# EasyEDA Pro project ESP32C3_Motor_MainControl.eprj, schematic ESP32C3_CAN_Host
Create Date: 2023-12-01; Page Name: ESP32C3PowerKey; Project Name: ESP32C3PowerKey; Schematic Name: ESP32C3PowerKey; Update Date: 2023-12-01; Company: SEU; Drawed: 陈申; Page Size: A4; Version: V1.0
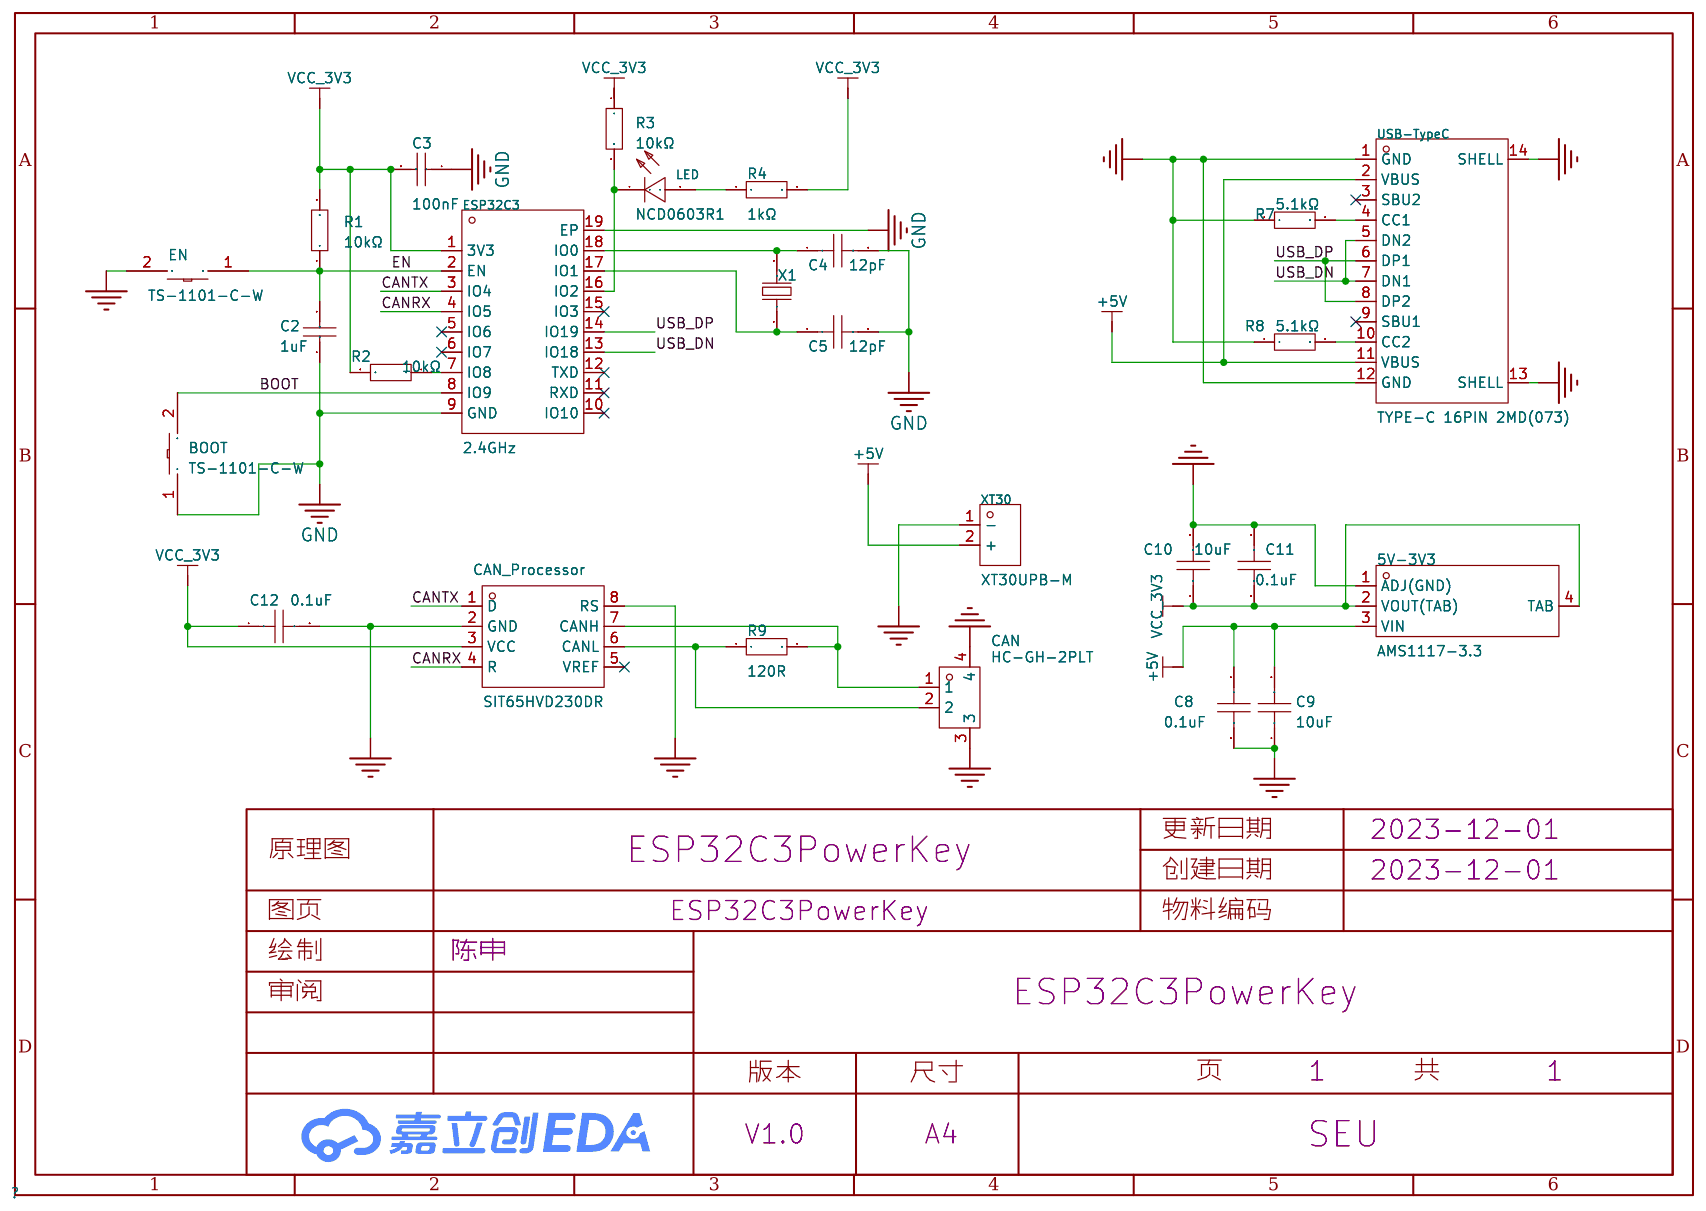
[diagram p0: schematic sheet]

## Parts
5V-3V3  AMS1117-3.3  [SOT-223-4_L6.5-W3.5-P2.30-LS7.0-BR]
BOOT  TS-1101-C-W  [SW-SMD_L6.0-W3.3-LS8.0]
C2  1uF  [C0603]
C3  100nF  [C0603]
C4  12pF  [C0603]
C5  12pF  [C0603]
C8  0.1uF  [C0603]
C9  10uF  [C0603]
C10  10uF  [C0603]
C11  0.1uF  [C0603]
C12  0.1uF  [C0603]
CAN  HC-GH-2PLT  [CONN-SMD_2P-P1.25_HCTL_HC-GH-2PLT]
CAN_Processor  SIT65HVD230DR  [SOP-8_L4.9-W3.9-P1.27-LS6.0-BL]
EN  TS-1101-C-W  [SW-SMD_L6.0-W3.3-LS8.0]
ESP32C3  2.4GHz  [BULETM-SMD_ESPRESSIF_ESP32-C3-WROOM-02-N4-4MB]
LED  NCD0603R1  [LED0603-RD_RED]
R1  10kΩ  [R0603]
R2  10kΩ  [R0603]
R3  10kΩ  [R0603]
R4  1kΩ  [R0603]
R7  5.1kΩ  [R0603]
R8  5.1kΩ  [R0603]
R9  120R  [R0603]
USB-TypeC  TYPE-C 16PIN 2MD(073)  [USB-C-SMD_TYPE-C-6PIN-2MD-073]
X1  32.768kHz  [FC-135R_L3.2-W1.5]
XT30  XT30UPB-M  [CONN-TH_XT30UPB-M]

## Library data of the parts
5V-3V3 = AMS1117-3.3_C347222: 输出类型:固定;输出极性:正;最大输入电压:18V;输出电压:3.3V;输出电流:1A;电源纹波抑制比(PSRR):60dB@(120Hz);; Supplier Part: C347222; Manufacturer: UMW(广东友台半导体); Supplier Footprint: SOT-223; JLCPCB Part Class: 扩展库; Datasheet: https://atta.szlcsc.com/upload/public/pdf/source/20211011/50CC665C22E3A66C08379A4A74BDA25C.pdf; Supplier: LCSC; Output Type: 固定; Output Polarity: 正; Number of Outputs: 1; Maximum Input Voltage: 18V; Output Voltage: 3.3V; Dropout Voltage: 1.3V@(1A); Output Current: 1A; Power Supply Rejection Ratio (PSRR): 60dB@(120Hz)
BOOT EN = TS-1101-C-W: 触点电流:50mA;额定电压(AC):-;额定电压(DC):12V;额定功率:-;绝缘电阻:-;电路结构:单刀单掷;安装方式:立贴;带灯:无;作用力:260gf;机械寿命:5万次;带支架:否;; LCSC Part Name: 立贴 6*3.6*2.5mm 轻触开关 一型3*6*2.5有白ZD b拉伸白色带淡绿按键 卷装; Supplier Part: C318938; Manufacturer: XKB Connectivity(中国星坤); Supplier Footprint: SMD; JLCPCB Part Class: Extended Part; Datasheet: https://atta.szlcsc.com/upload/public/pdf/source/20200227/C318938_C2E53B1EEDE37D980A33616AC086DE53.pdf; Supplier: LCSC; Contact Current: 50mA; Voltage Rating (DC): 12V; Circuit: 单刀单掷; Mounting Style: 立贴; Actuator Style: 矩形按钮; Actuator/Cap Color: 白色带淡绿; With Lamp: 无; Operating Force: 260gf; Mechanical Life: 5万次; Operating Temperature: -30℃~+85℃; Switch Length: 6mm; Switch Width: 3.6mm; Switch Height: 2.5mm; Strike Gundam: 否
C2 = CL10A105KA8NNNC: 容值:1uF;精度:±10%;额定电压:25V;温度系数:X5R;; LCSC Part Name: 1uF±10%25V; Supplier Part: C5673; Manufacturer: SAMSUNG(三星); Supplier Footprint: 0603; JLCPCB Part Class: ExtendedPart; Datasheet: https://atta.szlcsc.com/upload/public/pdf/source/20160103/1457707739994.pdf; Supplier: LCSC; Tolerance: ±10%; Voltage Rated: 25V; Temperature Coefficient: X5R
C3 = CC0603KRX7R9BB104: 容值:100nF;精度:±10%;额定电压:50V;材质(温度系数):X7R;; LCSC Part Name: 100nF ±10% 50V; Supplier Part: C14663; Manufacturer: YAGEO(国巨); Supplier Footprint: 0603; JLCPCB Part Class: Basic Part; Datasheet: https://atta.szlcsc.com/upload/public/pdf/source/20180910/C282072_33301C7F631E79921B82A8DAC6BCC5B3.pdf; Supplier: LCSC; Tolerance: ±10%; Voltage Rated: 50V; Temperature Coefficient: X7R
C4 C5 = CL10C120JB8NNNC: 容值:12pF;精度:±5%;额定电压:50V;材质(温度系数):C0G;; LCSC Part Name: 12pF ±5% 50V; Supplier Part: C38523; Manufacturer: SAMSUNG(三星); Supplier Footprint: 0603; JLCPCB Part Class: Basic Part; Datasheet: https://atta.szlcsc.com/upload/public/pdf/source/20160218/1457707763339.pdf; Supplier: LCSC; Tolerance: ±5%; Voltage Rated: 50V; Temperature Coefficient: C0G
C8-C12 = CAP_0603: Supplier Footprint: 0603
CAN = HC-GH-2PLT: 参考系列:GH;间距:1.25mm;插针结构:1x2P;排数:1;每排PIN数:2;公母:公型插针;安装方式:立贴;额定电流:1A;工作温度范围:-25℃~+85℃;; LCSC Part Name: GH 1.25mm 1x2P 立贴 立式贴片带扣 镀锡 2P; Supplier Part: C3011953; Manufacturer: HCTL(华灿天禄); Supplier Footprint: SMD,P=1.25mm; JLCPCB Part Class: 扩展库; Datasheet: https://atta.szlcsc.com/upload/public/pdf/source/20210728/C2845406_3EB3A7BF0D8EC31310CEF8E2A2CF0B88.pdf; Supplier: LCSC; Reference Series: GH; Pitch: 1.25mm; Pins Structure: 1x2P; Number of Rows: 1; Number of PINs Per Row: 2; Gender: 公型插针; Mounting Style: 立贴; Current Rating (Max): 1A; Operating Temperature Range: -25℃~+85℃
CAN_Processor = SIT65HVD230DR: 类型:-;; Supplier Part: C496619; Manufacturer: SIT(芯力特); Supplier Footprint: SOP-8; JLCPCB Part Class: 扩展库; Datasheet: https://atta.szlcsc.com/upload/public/pdf/source/20200313/C496619_AFEDC6182C941FC5FA6F8E58312D272B.pdf; Supplier: LCSC
ESP32C3 = ESP32-C3-WROOM-02-N4: 频率:2.4GHz;发射功率:20.5dBm;核心处理器:ESP32-C3;; Supplier Part: C2934560; Manufacturer: ESPRESSIF(乐鑫); Supplier Footprint: VFQFN-32-EP; JLCPCB Part Class: Extended Part; Datasheet: https://atta.szlcsc.com/upload/public/pdf/source/20220106/F07459EFFE1D7CBA94B4FB8A075146A6.pdf; Supplier: LCSC; Core Processor: ESP32-C3; Support Interface: I2C；GPIO；SPI；JTAG；UART；USB；I2S; Output Power: 20.5dBm
LED = NCD0603R1_C84263: 发光颜色:红灯;; LCSC Part Name: 红灯 0603红灯   正贴; Supplier Part: C84263; Manufacturer: 国星光电; Supplier Footprint: 0603; JLCPCB Part Class: 扩展库; Datasheet: https://atta.szlcsc.com/upload/public/pdf/source/20200820/C84263_DABC6A75E58F576973B407FDBA283D60.pdf; Supplier: LCSC; Emitted Color: 红灯
R1-R3 = 0603WAF1002T5E: 电阻类型:厚膜电阻;阻值:10kΩ;精度:±1%;功率:100mW;; LCSC Part Name: 厚膜电阻 10kΩ ±1% 100mW; Supplier Part: C25804; Manufacturer: UNI-ROYAL(厚声); Supplier Footprint: 0603; JLCPCB Part Class: Basic Part; Datasheet: https://atta.szlcsc.com/upload/public/pdf/source/20200306/C422600_1E6D84923E4A46A82E41ADD87F860B5C.pdf; Supplier: LCSC; Type: 厚膜电阻; Tolerance: ±1%; Power(Watts): 100mW; Temperature Coefficient: ±100ppm/℃; Overload Voltage (Max): 75V; Operating Temperature Range: -55℃~+155℃
R4 = 0603WAF1001T5E: 电阻类型:厚膜电阻;阻值:1kΩ;精度:±1%;功率:100mW;温度系数:±100ppm/℃;; LCSC Part Name: 厚膜电阻 1kΩ ±1% 100mW; Supplier Part: C21190; Manufacturer: UNI-ROYAL(厚声); Supplier Footprint: 0603; JLCPCB Part Class: Basic Part; Datasheet: https://atta.szlcsc.com/upload/public/pdf/source/20200306/C422600_1E6D84923E4A46A82E41ADD87F860B5C.pdf; Supplier: LCSC; Type: 厚膜电阻; Tolerance: ±1%; Power(Watts): 100mW; Temperature Coefficient: ±100ppm/℃; Overload Voltage (Max): 75V; Operating Temperature Range: -55℃~+155℃
R7 R8 = 0603WAF5101T5E: 电阻类型:厚膜电阻;阻值:5.1kΩ;精度:±1%;功率:100mW;; LCSC Part Name: 5.1kΩ ±1% 100mW; Supplier Part: C23186; Manufacturer: UNI-ROYAL(厚声); Supplier Footprint: 0603; JLCPCB Part Class: Basic Part; Datasheet: https://atta.szlcsc.com/upload/public/pdf/source/20200306/C422600_1E6D84923E4A46A82E41ADD87F860B5C.pdf; Supplier: LCSC; Type: 厚膜电阻; Tolerance: ±1%; Power(Watts): 100mW; Temperature Coefficient: ±100ppm/℃; Overload Voltage (Max): 75V; Operating Temperature Range: -55℃~+155℃
R9 = Res_0603: Supplier Footprint: 0603
USB-TypeC = TYPE-C 16PIN 2MD(073): 连接器类型:Type-C;标准:-;公母:母座;触点数量:16;端口数量:1;安装方式:卧贴;额定电流 - 电源:5A;工作温度范围:-25℃~+85℃;; LCSC Part Name: TYPE-C母座 16P 4脚插件带定位柱 不锈钢外壳 2次模顶; Supplier Part: C2765186; Manufacturer: SHOU HAN(首韩); Supplier Footprint: SMD; JLCPCB Part Class: 扩展库; Supplier: LCSC; Connector Type: Type-C; Gender: 母座; Number of Contacts: 16; Number of Ports: 1; Mounting Style: 卧贴; Current Rating - Power (Max): 5A; Operating Temperature Range: -25℃~+85℃
X1 = Q13FC1350000400: 频率:32.768kHz;频率公差:±20ppm;负载电容:12.5pF;; LCSC Part Name: 32.768kHz ±20ppm 12.5pF; Supplier Part: C32346; Manufacturer: EPSON(爱普生); Supplier Footprint: SMD3215-2P; JLCPCB Part Class: Basic Part; Datasheet: https://atta.szlcsc.com/upload/public/pdf/source/20190108/C32346_746D6B07EAF90824457A96480007685F.pdf; Supplier: LCSC; Crystal Type: 贴片无源晶振; Frequency Tolerance: ±20ppm; Load Capacitance: 12.5pF; Equivalent Series Resistance (ESR): 70kΩ; Operating Temperature: -40℃~+85℃
XT30 = XT30UPB-M: 类别:-;类型1:-;; LCSC Part Name: AMASS(艾迈斯)板载立式 航模锂电池控制器连接器插头 公头XT30UPB-M; Supplier Part: C428721; Manufacturer: AMASS(艾迈斯); JLCPCB Part Class: 扩展库; Datasheet: https://atta.szlcsc.com/upload/public/pdf/source/20230412/7B5DFEF57C9EA5273853390C734B3AC5.pdf; Supplier: LCSC; Brand: 艾迈斯; Type: 航模插头; Colour: 黄色; RatedVoltage: DC 500V; InterfaceType: 公头; MetalMaterial: 镀金; InsulationMaterial: PA; RatedCurrent: 15A; contact resistance: 0.65mΩ

## Nets
+5V: 5V-3V3.3(VIN) C8.1 C9.2 USB-TypeC.2(VBUS) USB-TypeC.11(VBUS) XT30.2(+)
GND: 5V-3V3.1(ADJ(GND)) BOOT.1 C2.1 C3.1 C4.2 C5.2 C8.2 C9.1 C10.2 C11.1 C12.2 CAN.3 CAN.4 CAN_Processor.2(GND) CAN_Processor.8(RS) EN.2 ESP32C3.9(GND) ESP32C3.19(EP) R7.1 R8.1 USB-TypeC.1(GND) USB-TypeC.12(GND) USB-TypeC.13(SHELL) USB-TypeC.14(SHELL) XT30.1(-)
VCC_3V3: 5V-3V3.2(VOUT(TAB)) 5V-3V3.4(TAB) C3.2 C10.1 C11.2 C12.1 CAN_Processor.3(VCC) ESP32C3.1(3V3) R1.2 R2.2 R3.1 R4.2
BOOT: BOOT.2 ESP32C3.8(IO9)
CANRX: CAN_Processor.4(R) ESP32C3.4(IO5)
CANTX: CAN_Processor.1(D) ESP32C3.3(IO4)
EN: C2.2 EN.1 ESP32C3.2(EN) R1.1
USB_DN: ESP32C3.13(IO18) USB-TypeC.5(DN2) USB-TypeC.7(DN1)
USB_DP: ESP32C3.14(IO19) USB-TypeC.6(DP1) USB-TypeC.8(DP2)
$1N818: C4.1 ESP32C3.18(IO0) X1.2
$1N819: C5.1 ESP32C3.17(IO1) X1.1
$1N821: ESP32C3.7(IO8) R2.1
$1N839: ESP32C3.16(IO2) LED.1(K) R3.2
$1N846: LED.2(A) R4.1
$1N1163: R7.2 USB-TypeC.4(CC1)
$1N1164: R8.2 USB-TypeC.10(CC2)
$1N1399: CAN.1 CAN_Processor.7(CANH) R9.2
$1N1400: CAN.2 CAN_Processor.6(CANL) R9.1

Not connected (* = marked no-connect by the designer): CAN_Processor 5(VREF)*; ESP32C3 5(IO6)* 6(IO7)* 10(IO10)* 11(RXD)* 12(TXD)* 15(IO3)*; USB-TypeC 3(SBU2)* 9(SBU1)*
